# EAGLE schematic tfg (EAGLE 9.1.0)
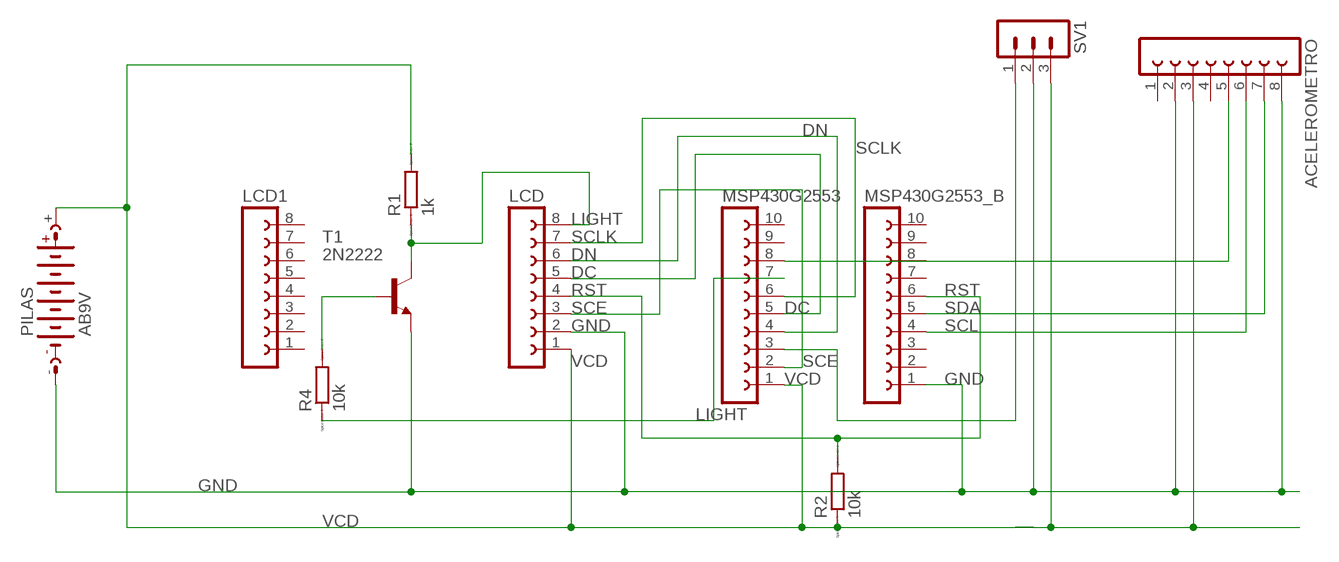
[diagram p0: schematic, sheet 1]

## Parts
ACELEROMETRO  FE08-1  [FE08]
LCD  FE08-1  [FE08]
LCD1  FE08-1  [FE08]
MSP430G2553  FE10-1  [FE10]
MSP430G2553_B  FE10-1  [FE10]
PILAS  AB9V  [AB9V]
R1  1k  R0207/10  [0207/10]
R2  10k  R0207/10  [0207/10]
R4  10k  R0207/10  [0207/10]
SV1  MA03-1  [MA03-1]
T1  2N2222  [TO18]

## Nets
DC: LCD.5 MSP430G2553.5
DN: LCD.6 MSP430G2553.4
GND: ACELEROMETRO.2 ACELEROMETRO.8 LCD.2 MSP430G2553_B.1 PILAS.- SV1.2 T1.1(E)
LIGHT: MSP430G2553.7 R4.1
N$1: R4.2 T1.2(B)
N$2: MSP430G2553.3 SV1.1
N$3: LCD.8 R1.1 T1.3(C)
N$4: ACELEROMETRO.5 MSP430G2553.8
RST: LCD.4 MSP430G2553_B.6 R2.2
SCE: LCD.3 MSP430G2553.2
SCL: ACELEROMETRO.6 MSP430G2553_B.4
SCLK: LCD.7 MSP430G2553.6
SDA: ACELEROMETRO.7 MSP430G2553_B.5
VCD: ACELEROMETRO.3 LCD.1 MSP430G2553.1 PILAS.+ R1.2 R2.1 SV1.3
Unconnected: ACELEROMETRO.1 ACELEROMETRO.4 LCD1.1 LCD1.2 LCD1.3 LCD1.4 LCD1.5 LCD1.6 LCD1.7 LCD1.8 MSP430G2553.9 MSP430G2553.10 MSP430G2553_B.2 MSP430G2553_B.3 MSP430G2553_B.7 MSP430G2553_B.8 MSP430G2553_B.9 MSP430G2553_B.10

## Library data of the parts
ACELEROMETRO LCD LCD1 = con-lsta:FE08-1: FEMALE HEADER; OC_FARNELL: unknown; OC_NEWARK: unknown
MSP430G2553 MSP430G2553_B = con-lsta:FE10-1: FEMALE HEADER; OC_FARNELL: unknown; OC_NEWARK: unknown
PILAS = battery:AB9V: 9-V BATTERY CLIP
R1 R2 R4 = eagle-ltspice:R: RESISTOR, European symbol; SPICEMODEL: NONE; SPICEPREFIX: R
SV1 = con-lstb:MA03-1: PIN HEADER; OC_FARNELL: unknown; OC_NEWARK: unknown
T1 = transistor:2N2222: NPN TRANSISTOR; SPICEPREFIX: J

## Net classes
1 prueba: width 0.813 mm, clearance 0.813 mm